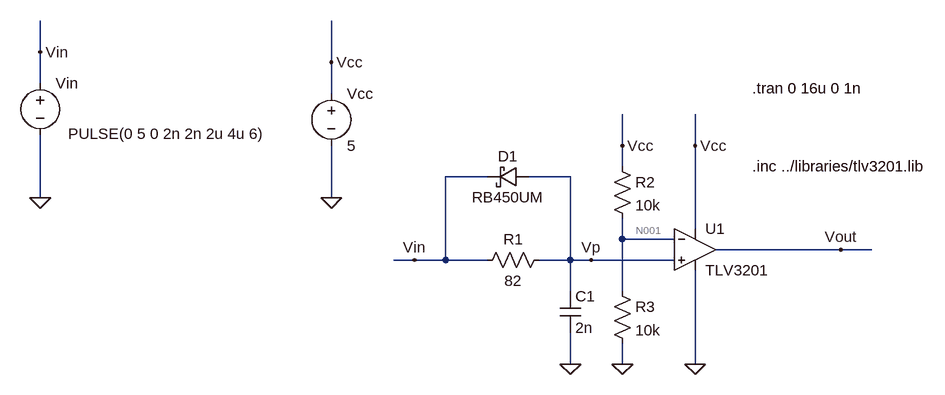
[diagram p0: schematic Deadtime.asc]
Deadtime.asc, the LTspice schematic file:
Version 4
SHEET 1 880 680
WIRE -800 -144 -800 -192
WIRE -352 -128 -352 -192
WIRE -800 -96 -800 -144
WIRE -352 -80 -352 -128
WIRE 96 0 96 -48
WIRE 208 0 208 -48
WIRE 96 32 96 0
WIRE -112 48 -176 48
WIRE 16 48 -48 48
WIRE -800 80 -800 -16
WIRE -352 80 -352 0
WIRE 208 128 208 0
WIRE 96 144 96 112
WIRE 176 144 96 144
WIRE 432 160 240 160
WIRE 480 160 432 160
WIRE -224 176 -256 176
WIRE -176 176 -176 48
WIRE -176 176 -224 176
WIRE -112 176 -176 176
WIRE 16 176 16 48
WIRE 16 176 -32 176
WIRE 48 176 16 176
WIRE 176 176 48 176
WIRE 16 224 16 176
WIRE 96 224 96 144
WIRE 16 336 16 288
WIRE 96 336 96 304
WIRE 208 336 208 192
FLAG 16 336 0
FLAG 96 336 0
FLAG -352 80 0
FLAG -352 -128 Vcc
FLAG 96 0 Vcc
FLAG 208 0 Vcc
FLAG 208 336 0
FLAG -800 80 0
FLAG -800 -144 Vin
FLAG -224 176 Vin
FLAG 432 160 Vout
FLAG 48 176 Vp
SYMBOL OpAmps\\opamp2 208 96 R0
SYMATTR InstName U1
SYMATTR Value TLV3201
SYMBOL res -16 160 R90
WINDOW 0 0 56 VBottom 2
WINDOW 3 32 56 VTop 2
SYMATTR InstName R1
SYMATTR Value 82
SYMBOL cap 0 224 R0
SYMATTR InstName C1
SYMATTR Value 2n
SYMBOL res 80 16 R0
SYMATTR InstName R2
SYMATTR Value 10k
SYMBOL res 80 208 R0
SYMATTR InstName R3
SYMATTR Value 10k
SYMBOL voltage -352 -96 R0
WINDOW 123 0 0 Left 0
WINDOW 39 0 0 Left 0
SYMATTR InstName Vcc
SYMATTR Value 5
SYMBOL voltage -800 -112 R0
WINDOW 3 195 109 Bottom 2
WINDOW 123 0 0 Left 0
WINDOW 39 0 0 Left 0
SYMATTR Value PULSE(0 5 0 2n 2n 2u 4u 6)
SYMATTR InstName Vin
SYMBOL schottky -48 32 R90
WINDOW 0 0 32 VBottom 2
WINDOW 3 32 32 VTop 2
SYMATTR InstName D1
SYMATTR Value RB450UM
SYMATTR Description Diode
SYMATTR Type diode
TEXT 296 32 Left 2 !.inc ../libraries/tlv3201.lib
TEXT 296 -88 Left 2 !.tran 0 16u 0 1n

The netlist it stands for:
* Deadtime.asc
XU1 Vp N001 Vcc 0 Vout TLV3201  ; pins In+ In- V+ V- OUT
R1 Vp Vin 82
C1 Vp 0 2n
R2 Vcc N001 10k
R3 N001 0 10k
Vcc Vcc 0 5
Vin Vin 0 PULSE(0 5 0 2n 2n 2u 4u 6)
D1 Vp Vin RB450UM
.model D D
.lib standard.dio
.inc ../libraries/tlv3201.lib
.tran 0 16u 0 1n
.backanno
.end

* Results of the author's LTspice run, read from the files saved beside the schematic
* Operating Point, zero values left out:
*   V(vcc) = 5 V
*   V(n001) = 2.5 V
*   I(R2) = 250 µA
*   I(R3) = 250 µA
*   I(Vcc) = -290 µA
*   Ix(u1:VCC) = 40 µA
*   Ix(u1:GND) = -40 µA
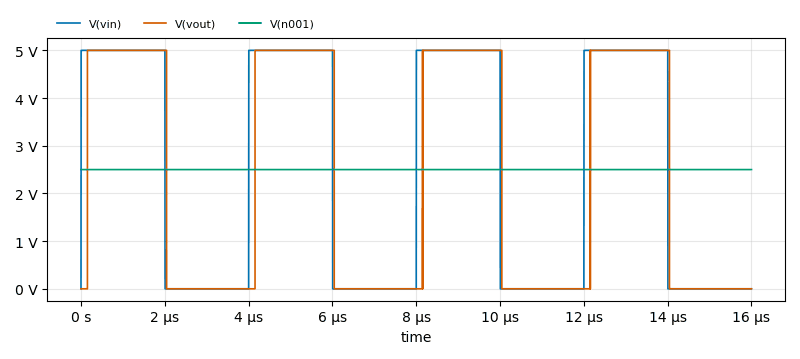
[diagram p1: Transient Analysis of Deadtime.asc, plotted from the saved traces]
* Transient Analysis, 1 run:
*   V(vin): min 0 V, max 5 V, average 2.502 V, rms 3.537 V, last 0 V
*   V(vout): min -53.05 µV, max 5 V, average 2.362 V, rms 3.437 V, last 0 V
*   V(n001): min 2.5 V, max 2.5 V, average 2.5 V, rms 2.5 V, last 2.5 V